# EAGLE schematic PDB_ESC_BEC (EAGLE 7.4.0)
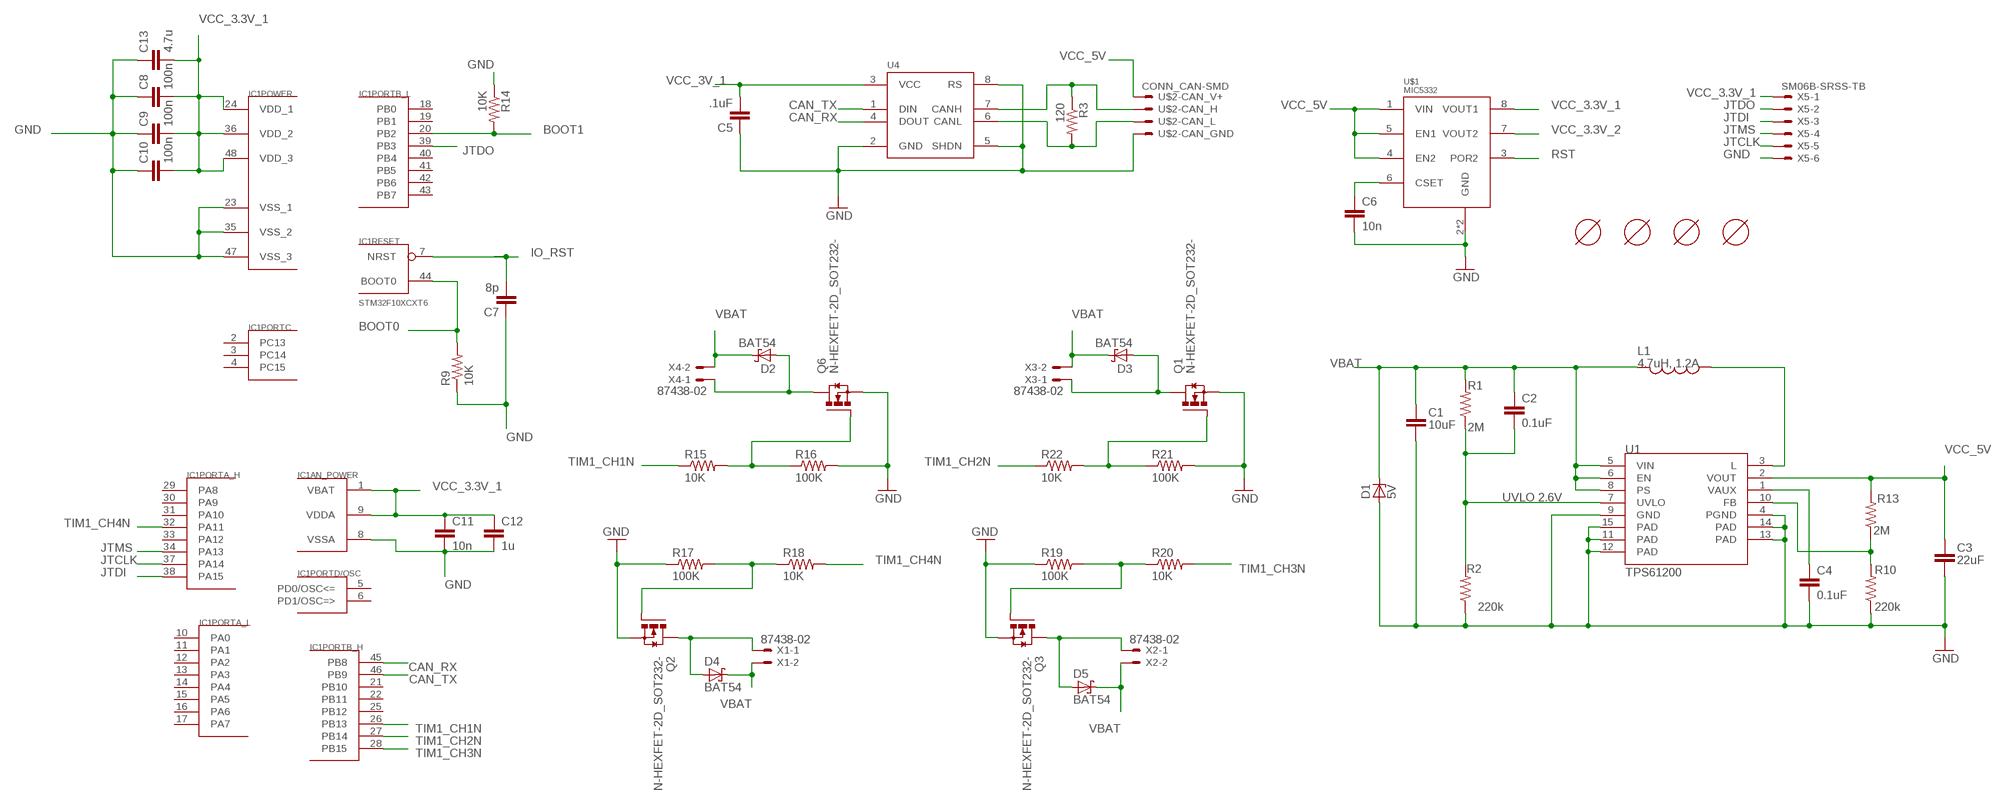
[diagram p0: schematic, sheet 1]

## Parts
C1  10uF  CAP1206  [1206]
C2  0.1uF  CAP0603-CAP  [0603-CAP]
C3  22uF  CAP0805  [0805]
C4  0.1uF  CAP0603-CAP  [0603-CAP]
C5  .1uF  C-EUC1206  [C1206]
C6  10n  CAP0603-CAP  [0603-CAP]
C7  8p  CAP1206  [1206-CAP]
C8  100n  CAP1206  [1206-CAP]
C9  100n  CAP1206  [1206-CAP]
C10  100n  CAP1206  [1206-CAP]
C11  10n  CAP1206  [1206-CAP]
C12  1u  CAP1206  [1206-CAP]
C13  4.7u  CAP1206  [1206-CAP]
D1  5V  ZENER-DIODEF126-10  [F126Z10]
D2  BAT54  [SOT23-3]
D3  BAT54  [SOT23-3]
D4  BAT54  [SOT23-3]
D5  BAT54  [SOT23-3]
IC1  STM32F10XCXT6  [TQFP48]
L1  4.7uH, 1.2A  INDUCTOR.  [CDRH2D09]
Q1  N-HEXFET-2D_SOT232-  [SOT223]
Q2  N-HEXFET-2D_SOT232-  [SOT223]
Q3  N-HEXFET-2D_SOT232-  [SOT223]
Q6  N-HEXFET-2D_SOT232-  [SOT223]
R1  2M  RESISTOR0603-RES  [0603-RES]
R2  220k  RESISTOR0603-RES  [0603-RES]
R3  120  RESISTOR1206  [1206]
R9  10K  RESISTOR1206  [1206]
R10  220k  RESISTOR0603-RES  [0603-RES]
R13  2M  RESISTOR0603-RES  [0603-RES]
R14  10K  RESISTOR1206  [1206]
R15  10K  RESISTOR1206  [1206]
R16  100K  RESISTOR1206  [1206]
R17  100K  RESISTOR1206  [1206]
R18  10K  RESISTOR1206  [1206]
R19  100K  RESISTOR1206  [1206]
R20  10K  RESISTOR1206  [1206]
R21  100K  RESISTOR1206  [1206]
R22  10K  RESISTOR1206  [1206]
U1  TPS61200  [QFN-10_PAD]
U4  MAX3051MAX3051ESA  [SO08]
U$1  MIC5332  [MLF-8-EPAD]
U$2  CONN_CAN-SMD  [S4B-PH-SM4-TB]
U$3  MOUNT-HOLE3.1MM  [MOUNT-HOLE3.1]
U$4  MOUNT-HOLE3.1MM  [MOUNT-HOLE3.1]
U$5  MOUNT-HOLE3.1MM  [MOUNT-HOLE3.1]
U$6  MOUNT-HOLE3.1MM  [MOUNT-HOLE3.1]
X1  87438-02  [87438-02]
X2  87438-02  [87438-02]
X3  87438-02  [87438-02]
X4  87438-02  [87438-02]
X5  SM06B-SRSS-TB  [SM06B-SRSS-TB]

## Nets
BOOT0: IC1.44(RESET:BOOT0) R9.2
BOOT1: IC1.20(PORTB_L:PB2) R14.2
CAN_RX: IC1.45(PORTB_H:PB8) U4.4(DOUT)
CAN_TX: IC1.46(PORTB_H:PB9) U4.1(DIN)
FB: R10.2 R13.1 U1.10(FB)
GND: C1.2 C3.2 C4.2 C5.1 C6.2 C7.P$1 C8.P$1 C9.P$1 C10.P$1 C11.P$2 C12.P$2 C13.P$1 D1.A IC1.8(AN_POWER:VSSA) IC1.23(POWER:VSS_1) IC1.35(POWER:VSS_2) IC1.47(POWER:VSS_3) Q1.3(S) Q2.3(S) Q3.3(S) Q6.3(S) R2.1 R9.1 R10.1 R14.1 R16.2 R17.1 R19.1 R21.2 U1.4(PGND) U1.9(GND) U1.11(PAD) U1.12(PAD) U1.13(PAD) U1.14(PAD) U1.15(PAD) U4.2(GND) U4.5(SHDN) U4.8(RS) U$1.2(GND) U$1.GND U$2.4 X5.6
IO_RST: C7.P$2 IC1.7(RESET:NRST)
JTCLK: IC1.37(PORTA_H:PA14) X5.5
JTDI: IC1.38(PORTA_H:PA15) X5.3
JTDO: IC1.39(PORTB_L:PB3) X5.2
JTMS: IC1.34(PORTA_H:PA13) X5.4
N$1: L1.P$1 U1.3(L)
N$2: D2.1(A) Q6.2(D) Q6.4(D) X4.1
N$3: Q1.1(G) R21.1 R22.2
N$4: D3.1(A) Q1.2(D) Q1.4(D) X3.1
N$5: Q2.1(G) R17.2 R18.1
N$6: Q6.1(G) R15.2 R16.1
N$7: D4.1(A) Q2.2(D) Q2.4(D) X1.1
N$8: Q3.1(G) R19.2 R20.1
N$9: D5.1(A) Q3.2(D) Q3.4(D) X2.1
N$10: R3.2 U4.6(CANL) U$2.3
N$12: C4.1 U1.1(VAUX)
N$13: R3.1 U4.7(CANH) U$2.2
N$14: C6.1 U$1.6(CSET)
RST: U$1.3(POR2)
TIM1_CH1N: IC1.26(PORTB_H:PB13) R15.1
TIM1_CH2N: IC1.27(PORTB_H:PB14) R22.1
TIM1_CH3N: IC1.28(PORTB_H:PB15) R20.2
TIM1_CH4N: IC1.32(PORTA_H:PA11) R18.2
UVLO: C2.2 R1.1 R2.2 U1.7(UVLO)
VBAT: C1.1 C2.1 D1.C D2.3(C) D3.3(C) D4.3(C) D5.3(C) L1.P$2 R1.2 U1.5(VIN) U1.6(EN) U1.8(PS) X1.2 X2.2 X3.2 X4.2
VCC_3.3V_1: C8.P$2 C9.P$2 C10.P$2 C11.P$1 C12.P$1 C13.P$2 IC1.1(AN_POWER:VBAT) IC1.9(AN_POWER:VDDA) IC1.24(POWER:VDD_1) IC1.36(POWER:VDD_2) IC1.48(POWER:VDD_3) U$1.8(VOUT1) X5.1
VCC_3.3V_2: U$1.7(VOUT2)
VCC_3V_1: C5.2 U4.3(VCC)
VCC_5V: C3.1 R13.2 U1.2(VOUT) U$1.1(VIN) U$1.4(EN2) U$1.5(EN1) U$2.1
Unconnected: IC1.2(PORTC:PC13) IC1.3(PORTC:PC14) IC1.4(PORTC:PC15) IC1.5(PORTD/OSC:PD0/OSC<=) IC1.6(PORTD/OSC:PD1/OSC=>) IC1.10(PORTA_L:PA0) IC1.11(PORTA_L:PA1) IC1.12(PORTA_L:PA2) IC1.13(PORTA_L:PA3) IC1.14(PORTA_L:PA4) IC1.15(PORTA_L:PA5) IC1.16(PORTA_L:PA6) IC1.17(PORTA_L:PA7) IC1.18(PORTB_L:PB0) IC1.19(PORTB_L:PB1) IC1.21(PORTB_H:PB10) IC1.22(PORTB_H:PB11) IC1.25(PORTB_H:PB12) IC1.29(PORTA_H:PA8) IC1.30(PORTA_H:PA9) IC1.31(PORTA_H:PA10) IC1.33(PORTA_H:PA12) IC1.40(PORTB_L:PB4) IC1.41(PORTB_L:PB5) IC1.42(PORTB_L:PB6) IC1.43(PORTB_L:PB7)

## Notes on the sheet
- UVLO 2.6V

## Library data of the parts
C1 C3 = CH_passive:CAP: Capacitor Standard 0603 ceramic capacitor, and 0.1" leaded capacitor.
C2 C4 C6 = SparkFun:CAP: Capacitor Standard 0603 ceramic capacitor, and 0.1" leaded capacitor.
C5 = resistor:C-EU: CAPACITOR, European symbol
C7-C13 = pixhawk2:CAP: Capacitor Standard 0603 ceramic capacitor, and 0.1" leaded capacitor.
D1 = diode:ZENER-DIODE: Z-Diode
D2-D5 = pixhawk2:BAT54: Schottky Diodes Source: Fairchild .. BAT54.pdf
IC1 = pixhawk2:STM32F10XCXT6: ST STM32F101/103 48pin LQFP
L1 = SparkFun:INDUCTOR: Inductors Basic Inductor/Choke - 0603 and 1206. Footprints are not proven and vary greatly between part numbers.
Q1-Q3 Q6 = transistor-power:N-HEXFET-2D_?-*: HEXFET® Power MOSFET 2 Drain connects http://www.irf.com/product-info/datasheets/data/irll014n.pdf
R1 R2 R10 R13 = SparkFun:RESISTOR: Resistor
R3 R9 R14-R22 = pixhawk2:RESISTOR: Resistor
U1 = SparkFun:TPS61200: DC to DC Booster
U4 = pixhawk2:MAX3051: 3.3-V CAN TRANSCEIVER
U$1 = pixhawk2:MIC5332
U$2 = pixhawk2:CONN_CAN
U$3-U$6 = pixhawk2:MOUNT-HOLE
X1-X4 = con-molex:87438-02: Wire-to-Board 1.50mm (.059") Pitch Header - Right Angle, SMT, Shrouded Source: http://www.molex.com/product/micro/87438.html; OC_FARNELL: 1711327; OC_NEWARK: unknown
X5 = con-jst2:?M06B-SRSS-TB: Disconnectable Crimp style connector, 1.0mm pitch 6 contacts